# Altium schematic sheet Sheet1.SchDoc
size A; SheetNumber: 1; SheetTotal: 1
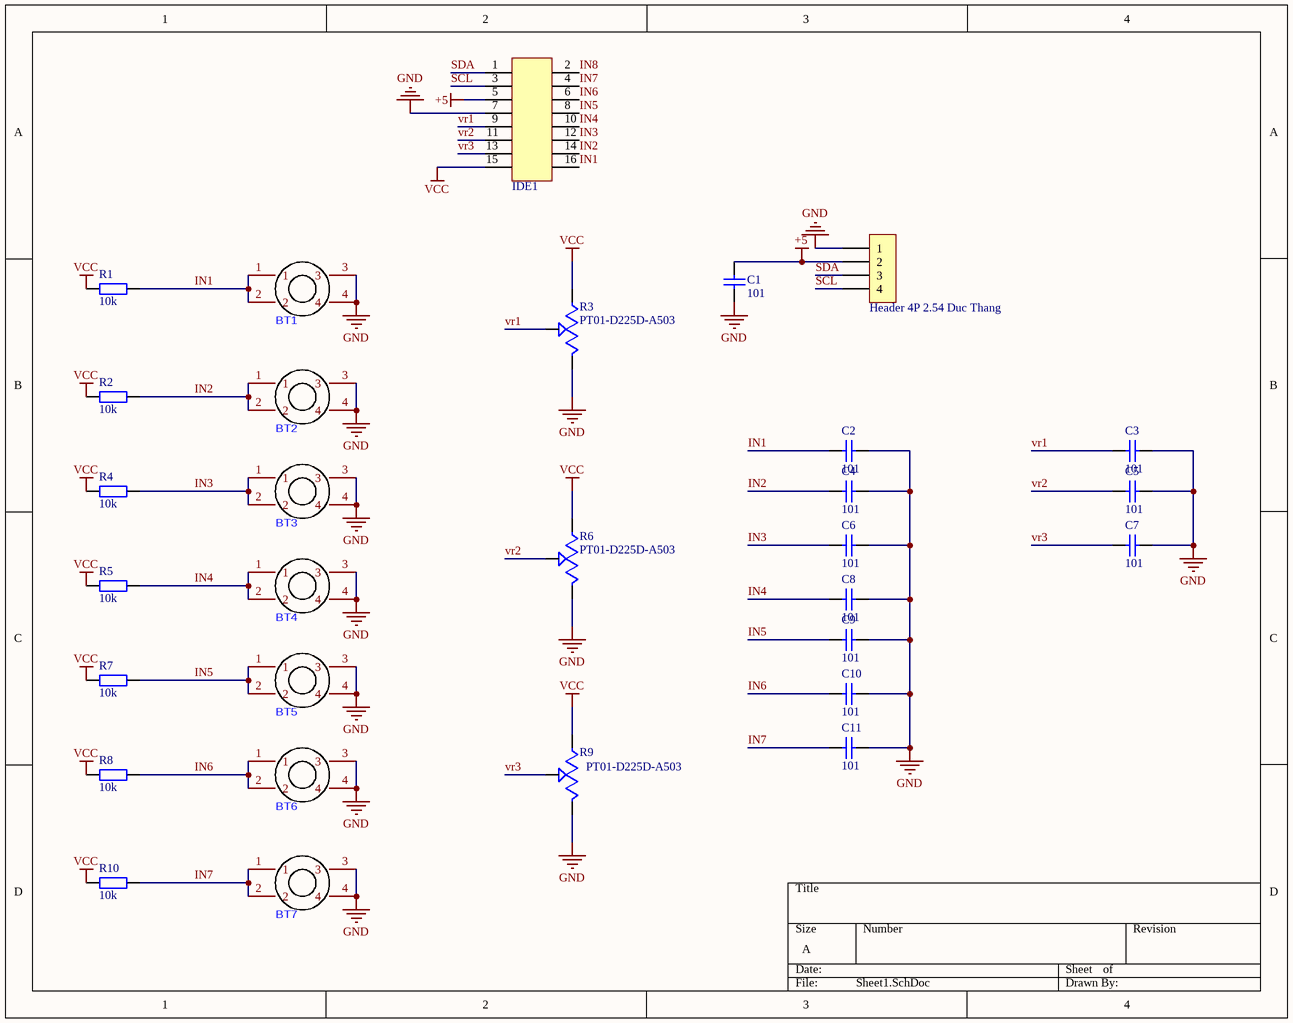
[diagram p0: Sheet1.SchDoc]

## Parts
BT1  Nut Nhan 4 chan 12x12  [12X12 BUTTOM Blue]  (value not drawn)
BT2  Nut Nhan 4 chan 12x12  [12X12 BUTTOM Blue]  (value not drawn)
BT3  Nut Nhan 4 chan 12x12  [12X12 BUTTOM Blue]  (value not drawn)
BT4  Nut Nhan 4 chan 12x12  [12X12 BUTTOM Blue]  (value not drawn)
BT5  Nut Nhan 4 chan 12x12  [12X12 BUTTOM Blue]  (value not drawn)
BT6  Nut Nhan 4 chan 12x12  [12X12 BUTTOM Blue]  (value not drawn)
BT7  Nut Nhan 4 chan 12x12  [12X12 BUTTOM Blue]  (value not drawn)
C1  101  [tu 0603]
C2  101  [tu 0603]
C3  101  [tu 0603]
C4  101  [tu 0603]
C5  101  [tu 0603]
C6  101  [tu 0603]
C7  101  [tu 0603]
C8  101  [tu 0603]
C9  101  [tu 0603]
C10  101  [tu 0603]
C11  101  [tu 0603]
IDE1  IDE16  [IDE16 DT]  (value not drawn)
LCD  Header 4P 2.54 Duc Thang  [XH2.54M-4]
R1  10k  [tro smd 0603]
R2  10k  [tro smd 0603]
R3  PT01-D225D-A503  [TRIM_PT01-D225D-A503]
R4  10k  [tro smd 0603]
R5  10k  [tro smd 0603]
R6  PT01-D225D-A503  [TRIM_PT01-D225D-A503]
R7  10k  [tro smd 0603]
R8  10k  [tro smd 0603]
R9  PT01-D225D-A503  [TRIM_PT01-D225D-A503]
R10  10k  [tro smd 0603]

## Nets
+5: C1.1 IDE1.5 LCD.2
GND: BT1.3 BT1.4 BT2.3 BT2.4 BT3.3 BT3.4 BT4.3 BT4.4 BT5.3 BT5.4 BT6.3 BT6.4 BT7.3 BT7.4 C1.2 C2.1 C3.1 C4.1 C5.1 C6.1 C7.1 C8.1 C9.1 C10.1 C11.1 IDE1.7 LCD.1 R3.1 R6.1 R9.1
VCC: IDE1.15 R1.1 R2.1 R3.3 R4.1 R5.1 R6.3 R7.1 R8.1 R9.3 R10.1
IN1: BT1.1 BT1.2 C2.2 IDE1.16 R1.2
IN2: BT2.1 BT2.2 C4.2 IDE1.14 R2.2
IN3: BT3.1 BT3.2 C6.2 IDE1.12 R4.2
IN4: BT4.1 BT4.2 C8.2 IDE1.10 R5.2
IN5: BT5.1 BT5.2 C9.2 IDE1.8 R7.2
IN6: BT6.1 BT6.2 C10.2 IDE1.6 R8.2
IN7: BT7.1 BT7.2 C11.2 IDE1.4 R10.2
IN8: IDE1.2
SCL: IDE1.3 LCD.4
SDA: IDE1.1 LCD.3
vr1: C3.2 IDE1.9 R3.2
vr2: C5.2 IDE1.11 R6.2
vr3: C7.2 IDE1.13 R9.2

## Library data of the parts
C1-C11 = Tu 0603 104 50V 10%: Dán; Don_Vi: Con; So_Chan: 2; Ten_Linh_Kien: Tụ 0603 104-100nF 10% 50V; Ma_Hang: MH004568; Chung_Loai: Dán; Kieu_Chan: *
IDE1 = IDE 16 DT
LCD = Header 4P 2.54 Duc Thang: Cắm; Ten_Linh_Kien: Header 4P XH2.54-4P Đực Thẳng; Don_Vi: Con; Ma_Hang: MH001285; Chung_Loai: Cắm
R1 R2 R4 R5 R7 R8 R10 = Tro 0603 5% 10k: Dán; Don_Vi: Con; So_Chan: 2; Ten_Linh_Kien: Trở 0603 5% 10k; Ma_Hang: MH006316; Chung_Loai: Dán; Kieu_Chan: *
R3 R6 R9 = PT01-D225D-A503: 10 mm, Vertical, Logarithmic, 50 kÎ©, Through Hole, D-cut Rotary Potentiometer; MF: Same Sky; SnapEDA_Link: https://www.snapeda.com/parts/PT01-D225D-A503/Same+Sky/view-part/?ref=snap; Package: None; Value: *; MP: PT01-D225D-A503; Check_prices: https://www.snapeda.com/parts/PT01-D225D-A503/Same+Sky/view-part/?ref=eda